# Altium schematic sheet Top_Level.SchDoc
size B; SheetNumber: 2; SheetTotal: 13
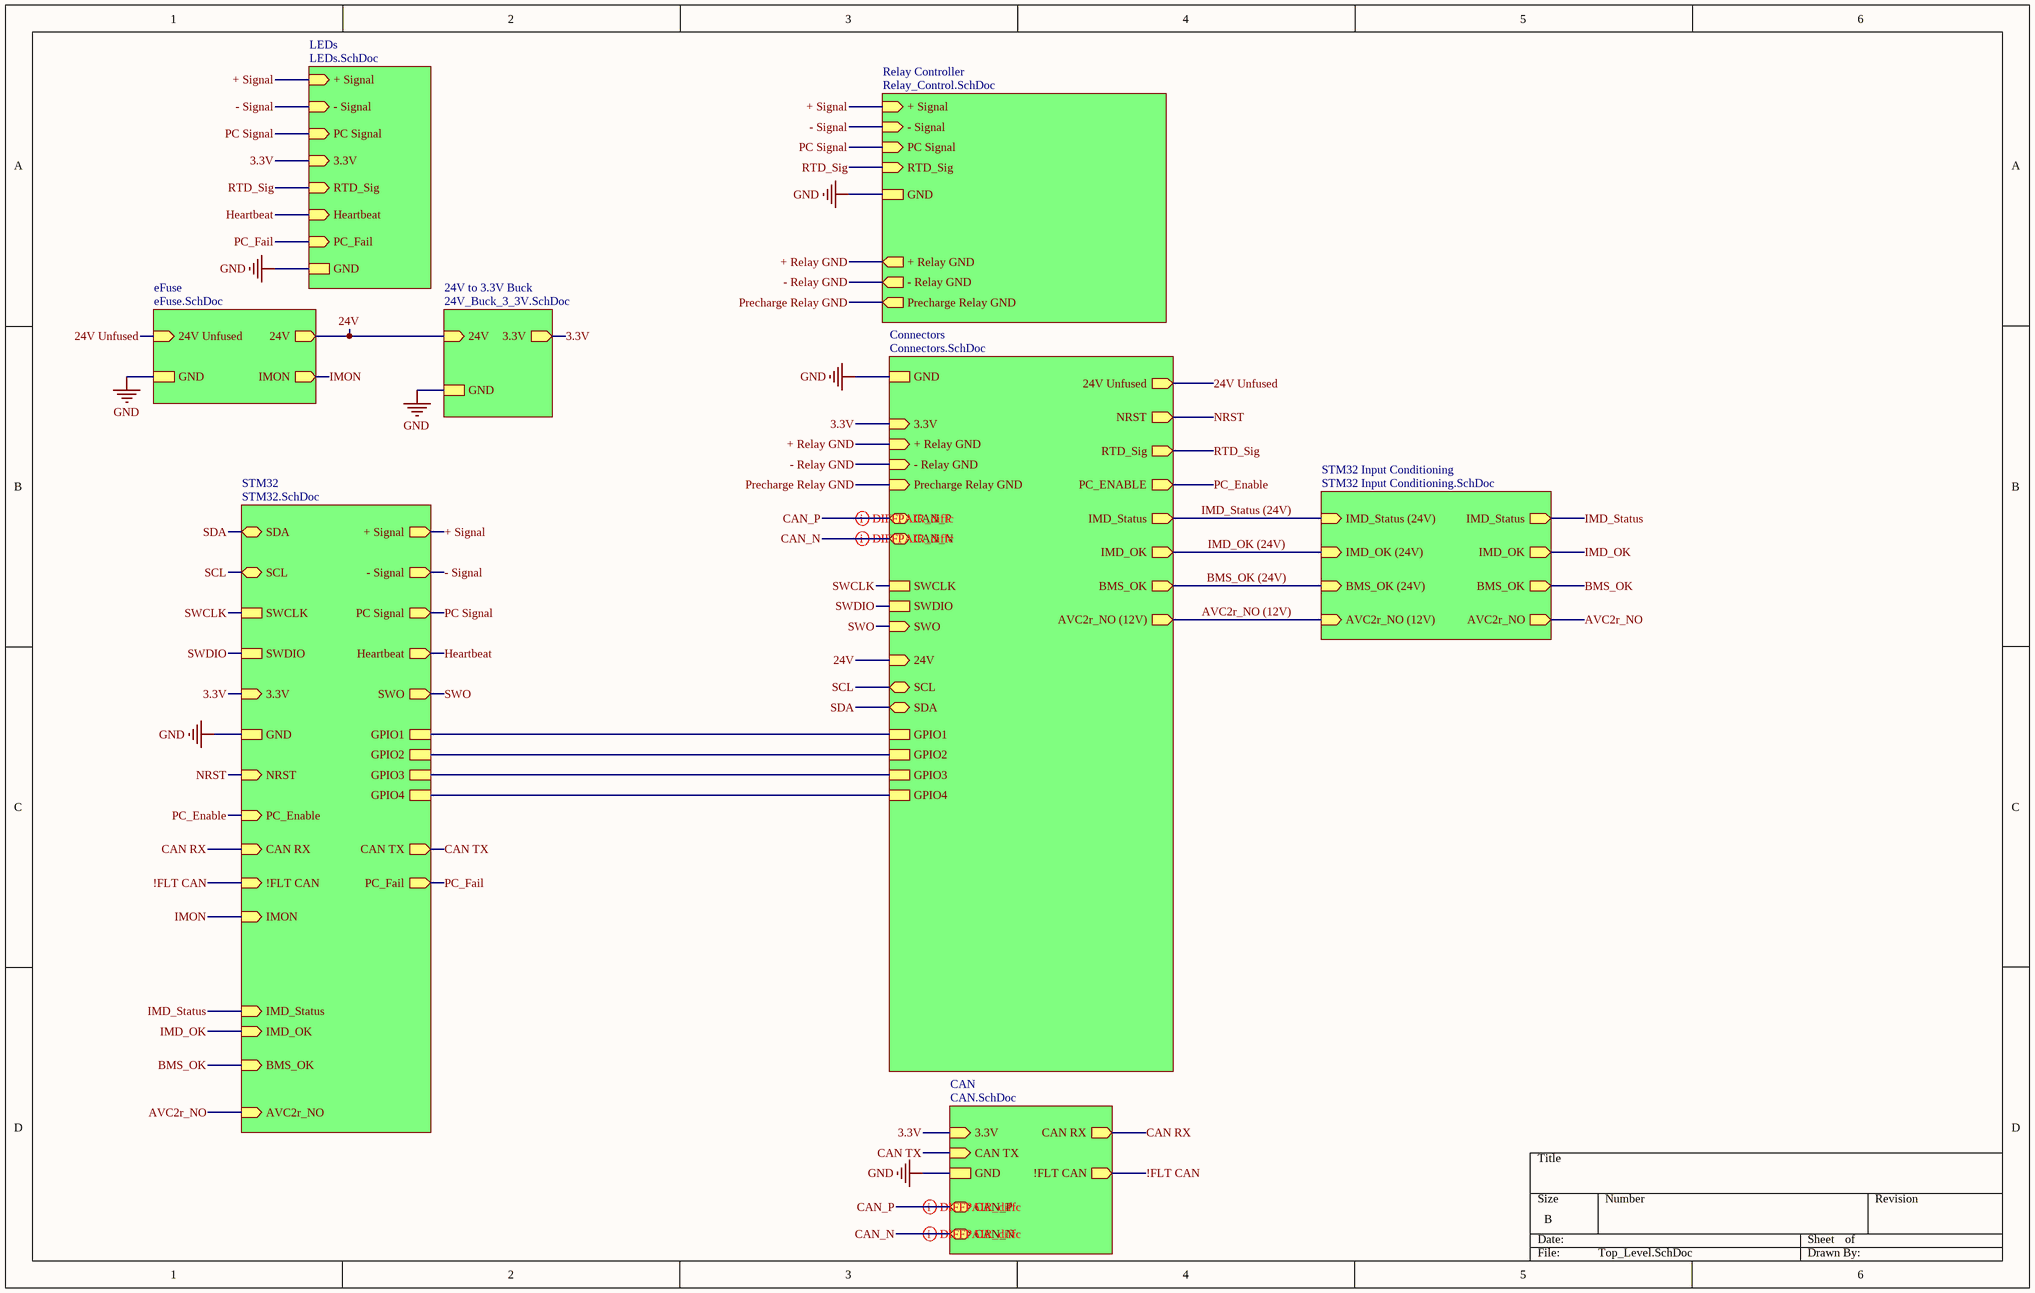
[diagram p0: Top_Level.SchDoc]

## Sub-sheets
24V to 3.3V Buck = 24V_Buck_3_3V.SchDoc: 24V (in), GND, 3.3V (out)
CAN = CAN.SchDoc: 3.3V (in), GND, CAN RX (out), CAN TX (in), !FLT CAN (out), CAN_P (bidir), CAN_N (bidir)
Connectors = Connectors.SchDoc: GND, + Relay GND (in), - Relay GND (in), Precharge Relay GND (in), 24V Unfused (out), 3.3V (in), NRST (out), GPIO1, GPIO2, GPIO3, GPIO4, PC_ENABLE (out), CAN_P (bidir), CAN_N (bidir), RTD_Sig (out), 24V (in), SWCLK, SWDIO, SWO (in), SCL (bidir), SDA (bidir), IMD_Status (out), IMD_OK (out), BMS_OK (out), AVC2r_NO (12V) (out)
eFuse = eFuse.SchDoc: 24V Unfused (in), GND, 24V (out), IMON (out)
LEDs = LEDs.SchDoc: + Signal (in), - Signal (in), PC Signal (in), 3.3V (in), GND, RTD_Sig (in), Heartbeat (in), PC_Fail (in)
Relay Controller = Relay_Control.SchDoc: + Signal (in), - Signal (in), PC Signal (in), RTD_Sig (in), GND, + Relay GND (out), - Relay GND (out), Precharge Relay GND (out)
STM32 = STM32.SchDoc: SDA (bidir), SCL (bidir), 3.3V (in), + Signal (out), - Signal (out), PC Signal (out), GND, SWCLK, SWDIO, SWO (out), NRST (in), GPIO1, GPIO2, GPIO3, GPIO4, PC_Enable (in), CAN TX (out), CAN RX (in), Heartbeat (out), !FLT CAN (in), IMON (in), PC_Fail (out), IMD_Status (in), IMD_OK (in), BMS_OK (in), AVC2r_NO (in)
STM32 Input Conditioning = STM32 Input Conditioning.SchDoc: IMD_Status (24V) (in), BMS_OK (24V) (in), IMD_Status (out), IMD_OK (24V) (in), IMD_OK (out), AVC2r_NO (12V) (in), BMS_OK (out), AVC2r_NO (out)

## Nets
GND: sheet Relay Controller/GND, sheet Connectors/GND, sheet LEDs/GND, sheet STM32/GND, sheet eFuse/GND, sheet 24V to 3.3V Buck/GND, sheet CAN/GND
3.3V: sheet Connectors/3.3V, sheet LEDs/3.3V, sheet STM32/3.3V, sheet 24V to 3.3V Buck/3.3V, sheet CAN/3.3V
24V: sheet Connectors/24V, sheet eFuse/24V, sheet 24V to 3.3V Buck/24V
24V Unfused: sheet Connectors/24V Unfused, sheet eFuse/24V Unfused
!FLT CAN: sheet STM32/!FLT CAN, sheet CAN/!FLT CAN
+ Relay GND: sheet Relay Controller/+ Relay GND, sheet Connectors/+ Relay GND
+ Signal: sheet Relay Controller/+ Signal, sheet LEDs/+ Signal, sheet STM32/+ Signal
- Relay GND: sheet Relay Controller/- Relay GND, sheet Connectors/- Relay GND
- Signal: sheet Relay Controller/- Signal, sheet LEDs/- Signal, sheet STM32/- Signal
AVC2r_NO: sheet STM32/AVC2r_NO, sheet STM32 Input Conditioning/AVC2r_NO
AVC2r_NO (12V): sheet Connectors/AVC2r_NO (12V), sheet STM32 Input Conditioning/AVC2r_NO (12V)
BMS_OK: sheet STM32/BMS_OK, sheet STM32 Input Conditioning/BMS_OK
BMS_OK (24V): sheet Connectors/BMS_OK, sheet STM32 Input Conditioning/BMS_OK (24V)
CAN RX: sheet STM32/CAN RX, sheet CAN/CAN RX
CAN TX: sheet STM32/CAN TX, sheet CAN/CAN TX
CAN_N: sheet Connectors/CAN_N, sheet CAN/CAN_N
CAN_P: sheet Connectors/CAN_P, sheet CAN/CAN_P
Heartbeat: sheet LEDs/Heartbeat, sheet STM32/Heartbeat
IMD_OK: sheet STM32/IMD_OK, sheet STM32 Input Conditioning/IMD_OK
IMD_OK (24V): sheet Connectors/IMD_OK, sheet STM32 Input Conditioning/IMD_OK (24V)
IMD_Status: sheet STM32/IMD_Status, sheet STM32 Input Conditioning/IMD_Status
IMD_Status (24V): sheet Connectors/IMD_Status, sheet STM32 Input Conditioning/IMD_Status (24V)
IMON: sheet STM32/IMON, sheet eFuse/IMON
NRST: sheet Connectors/NRST, sheet STM32/NRST
PC Signal: sheet Relay Controller/PC Signal, sheet LEDs/PC Signal, sheet STM32/PC Signal
PC_Enable: sheet Connectors/PC_ENABLE, sheet STM32/PC_Enable
PC_Fail: sheet LEDs/PC_Fail, sheet STM32/PC_Fail
Precharge Relay GND: sheet Relay Controller/Precharge Relay GND, sheet Connectors/Precharge Relay GND
RTD_Sig: sheet Relay Controller/RTD_Sig, sheet Connectors/RTD_Sig, sheet LEDs/RTD_Sig
SCL: sheet Connectors/SCL, sheet STM32/SCL
SDA: sheet Connectors/SDA, sheet STM32/SDA
SWCLK: sheet Connectors/SWCLK, sheet STM32/SWCLK
SWDIO: sheet Connectors/SWDIO, sheet STM32/SWDIO
SWO: sheet Connectors/SWO, sheet STM32/SWO
(unnamed): sheet Connectors/GPIO1, sheet STM32/GPIO1
(unnamed): sheet Connectors/GPIO2, sheet STM32/GPIO2
(unnamed): sheet Connectors/GPIO3, sheet STM32/GPIO3
(unnamed): sheet Connectors/GPIO4, sheet STM32/GPIO4

## Layout directives
differential pair; differential pair class diffc; differential pair: CAN_N, CAN_P